# EAGLE design slave (EAGLE 9.0.0)
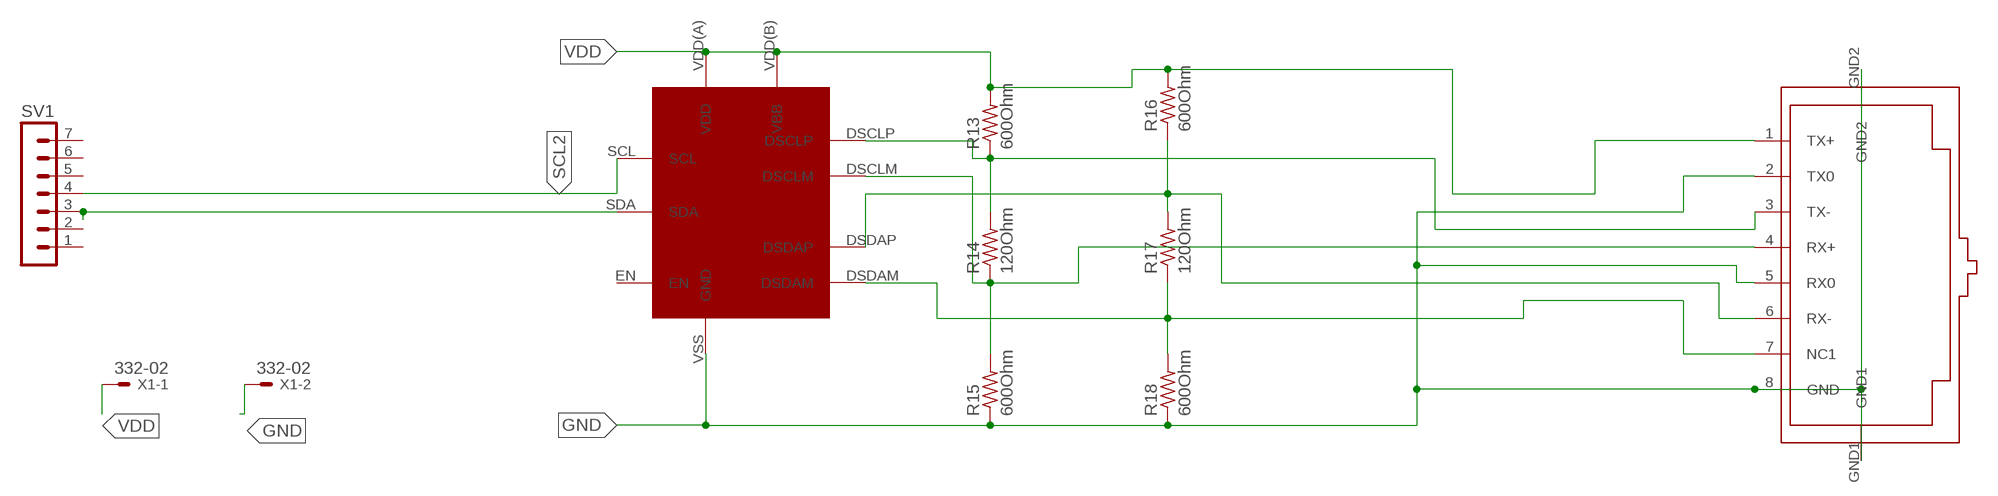
[diagram p0: schematic, sheet 1]

## Parts
R13  600Ohm  R-US_0414/15  [0414/15]
R14  120Ohm  R-US_0414/15  [0414/15]
R15  600Ohm  R-US_0414/15  [0414/15]
R16  600Ohm  R-US_0414/15  [0414/15]
R17  120Ohm  R-US_0414/15  [0414/15]
R18  600Ohm  R-US_0414/15  [0414/15]
SV1  MA07-1  [MA07-1]
U$3  PCA9615  [PCA9615]
U$6  RJ45-8N4-B  [RJ45-8N4-B]
X1  332-02  [332-02]

## Nets
GND: R15.1 R18.1 U$3.VSS(GND) U$6.2(TX0) U$6.5(RX0) U$6.8(GND) U$6.GND1 U$6.GND2 X1.2
N$1: SV1.3 U$3.SDA
N$11: R13.1 R14.2 U$3.DSCLP U$6.3(TX-)
N$12: R14.1 R15.2 U$3.DSCLM U$6.4(RX+)
N$15: R16.1 R17.2 U$3.DSDAP U$6.6(RX-)
N$16: R17.1 R18.2 U$3.DSDAM U$6.7(NC1)
SCL2: SV1.4 U$3.SCL
VDD: R13.2 R16.2 U$3.VDD(A)(VDD) U$3.VDD(B)(VBB) U$6.1(TX+) X1.1
Unconnected: SV1.1 SV1.2 SV1.5 SV1.6 SV1.7 U$3.EN

## Library data of the parts
R13-R18 = resistor:R-US_: RESISTOR, American symbol
SV1 = con-lstb:MA07-1: PIN HEADER; OC_FARNELL: unknown; OC_NEWARK: unknown
U$3 = PCA9615:PCA9615
U$6 = con-amphenol-rj45-ld:RJ45-8N4-B: RJ45 socket with integrated magnetics Naming: Amphenol LMJ1598824110DT39 TME RJ45-TRAFO Author: Petr Kalandra <mailto:kalandrap@gmail.com> Datasheet: http://zefiryn.tme.pl/dok/zlacza/rjtrafo.pdf
X1 = con-garry:332-02: 2 Pin - 2mm Dual Row Source: www.mpe-connector.de / garry_shortform_2012.pdf

## Net classes
0 VDD: width 0.178 mm, drill 0.127 mm, clearance 0.127 mm

## Board
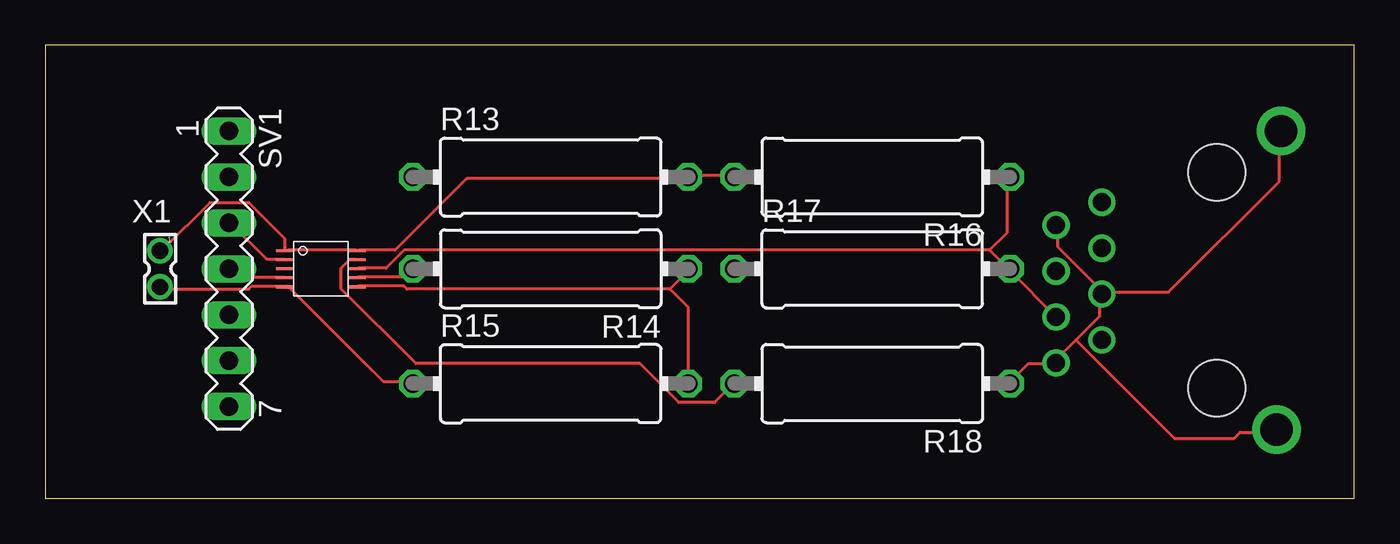
[diagram p1: board, top side]
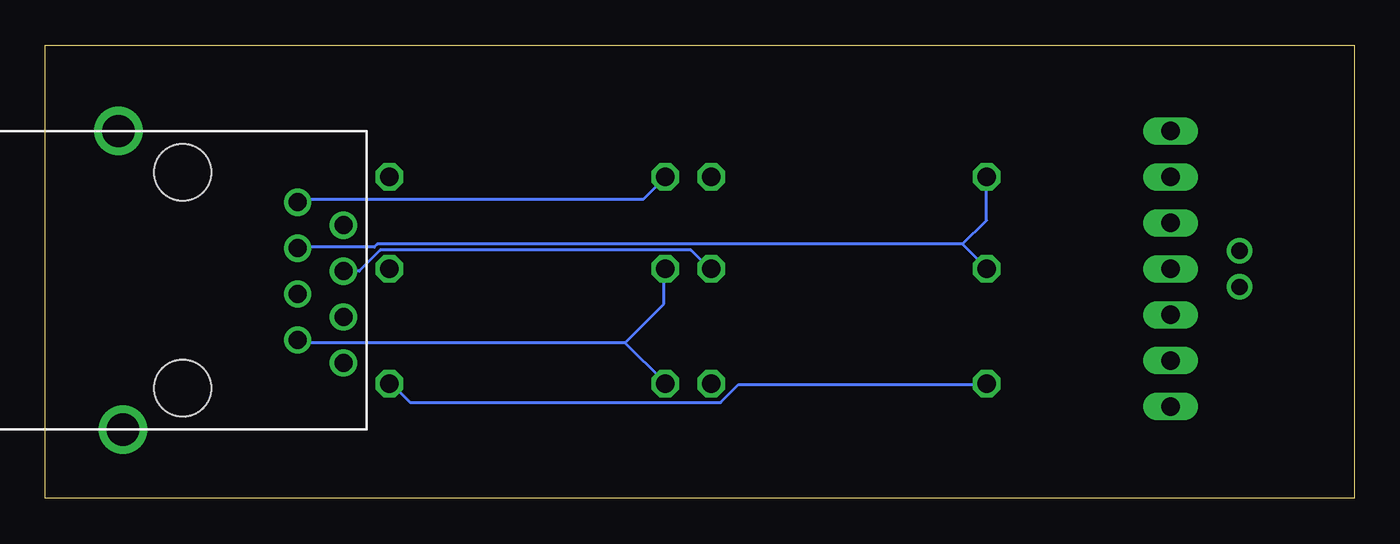
[diagram p2: board, bottom side, seen from below]

Size 72.37 x 25.07 mm. Coordinates in mm from the lower left corner, seen from the top.
Outline: 0,0 72.37,0 72.37,25.07 0,25.07 0,0
Copper layers (1*16): Top 0.035mm / dielectric 1.5mm / Bottom 0.035mm
Design rules "default": minimum track width 6mil, minimum drill 0.35mm, track to track 6mil, track to pad 6mil, pad to pad 6mil, via to via 6mil, smd to smd 6mil, copper to edge 40mil, drill to drill 6mil, minimum pad ring 10mil, minimum via ring 8mil, stop-mask expansion 4mil, vias tented up to drill 0mil, thermal gap 10mil

### Footprints (pad centres in the part's own frame; a part is rotated, then mirrored left to right if it is on the bottom)
0414/15 = drill 1.016 octagon: 1 -7.62,0; 2 7.62,0
MA07-1 = drill 1.016 long: 1 -7.62,0; 2 -5.08,0; 3 -2.54,0; 4 0,0; 5 2.54,0; 6 5.08,0; 7 7.62,0
PCA9615 = smd 0.95 x 0.15: DSCLM 2,-1; DSCLP 2,-0.5; DSDAM 2,0.5; DSDAP 2,0; EN -2,0; SCL -2,-0.5; SDA -2,0.5; VDD(A) -2,1; VDD(B) 2,1; VSS -2,-1
RJ45-8N4-B = drill 1: 1 -4.953,6.35; 2 -3.683,8.89; 3 -2.413,6.35; 4 -1.143,8.89; 5 0.127,6.35; 6 1.397,8.89; 7 2.667,6.35; 8 3.937,8.89 | drill 1.786: GND1 -8.89,-3.556; GND2 7.62,-3.302 | hole 3.149: -6.604,0; 5.334,0
332-02 = drill 0.9 pad 1.27: 1 0,-1; 2 0,1

### Placement (x,y rotation side)
R13  27.94,17.78 0 top
R14  27.94,12.7 180 top
R15  27.94,6.35 0 top
R16  45.72,17.78 180 top
R17  45.72,12.7 0 top
R18  45.72,6.35 180 top
SV1  10.16,12.7 270 top
U$3  15.24,12.7 0 top
U$6  64.77,11.43 270 bottom
X1  6.35,12.7 180 top

### Tracks (layer width: path | path; a pad name or v marks a point on that pad's centre or on a via)
GND
  Top 0.178: X1.2 6.46,11.58 11.25,11.58 11.42,11.75 13.23,11.75 U$3.VSS 13.4,11.75 18.68,6.46 20.17,6.46 R15.1 | R18.1 53.35,6.46 54.34,7.45 55.83,7.45 U$6.8 55.83,7.62 56.98,8.78 | 56.98,8.78 58.31,10.1 58.31,11.25 U$6.5 58.47,11.42 | 58.47,11.42 55.99,13.89 55.99,15.05 U$6.2 | 56.98,8.78 62.43,3.33 65.73,3.33 66.06,3.66 68.05,3.66 U$6.GND2 | 58.47,11.42 62.1,11.42 68.21,17.53 68.21,20.17 U$6.GND1
  Bottom 0.178: R15.1 20.33,6.3 34.04,6.3 35.03,5.31 52.2,5.31 53.19,6.3 R18.1
N$1
  Top 0.178: U$3.SDA 13.23,13.23 12.24,13.23 10.26,15.21 SV1.3
N$11
  Top 0.178: U$3.DSCLP 17.36,12.24 19.84,12.24 20.17,12.57 R14.2
  Bottom 0.178: 21.65,14.06 54.01,14.06 54.18,13.89 58.31,13.89 U$6.3 | 21.65,14.06 20.33,12.74 R14.2 | 21.65,14.06 20.33,15.38 20.33,17.69 R13.1
N$12
  Top 0.178: 34.53,11.58 20,11.58 19.84,11.75 17.36,11.75 U$3.DSCLM | 34.53,11.58 35.52,12.57 R14.1 | 34.53,11.58 35.52,10.59 35.52,6.46 R15.2
  Bottom 0.178: U$6.4 55,12.57 53.85,13.73 36.68,13.73 35.69,12.74 R14.1
N$15
  Top 0.178: 52.2,13.73 19.84,13.73 18.85,12.74 17.36,12.74 U$3.DSDAP | 52.2,13.73 53.19,12.74 R17.2 53.35,12.57 55.83,10.1 U$6.6 | 52.2,13.73 53.19,14.72 53.19,17.69 R16.1
N$16
  Top 0.178: U$3.DSDAM 17.2,13.23 16.87,13.23 16.37,12.74 16.37,11.58 20.5,7.45 32.88,7.45 35.03,5.31 37.01,5.31 38,6.3 R18.2
  Bottom 0.178: 40.31,8.61 58.31,8.61 U$6.7 | 40.31,8.61 38.16,6.46 R18.2 | 40.31,8.61 38.16,10.76 38.16,12.57 R17.1
SCL2
  Top 0.178: U$3.SCL 13.23,12.24 10.59,12.24 10.26,12.57 SV1.4
VDD
  Top 0.178: X1.1 6.46,13.73 9.11,16.37 11.25,16.37 13.23,14.39 13.23,13.73 U$3.VDD(A) 13.4,13.73 17.2,13.73 U$3.VDD(B) 17.36,13.73 19.34,13.73 23.3,17.69 35.52,17.69 R13.2 35.69,17.86 38,17.86 R16.2
  Bottom 0.178: U$6.1 58.31,16.53 39.32,16.53 38.16,17.69 R16.2